# Altium project US_EPS_HW.PrjPcb (part 2 of 2)

## Sheet US_EPS_MCU.SchDoc
size A3
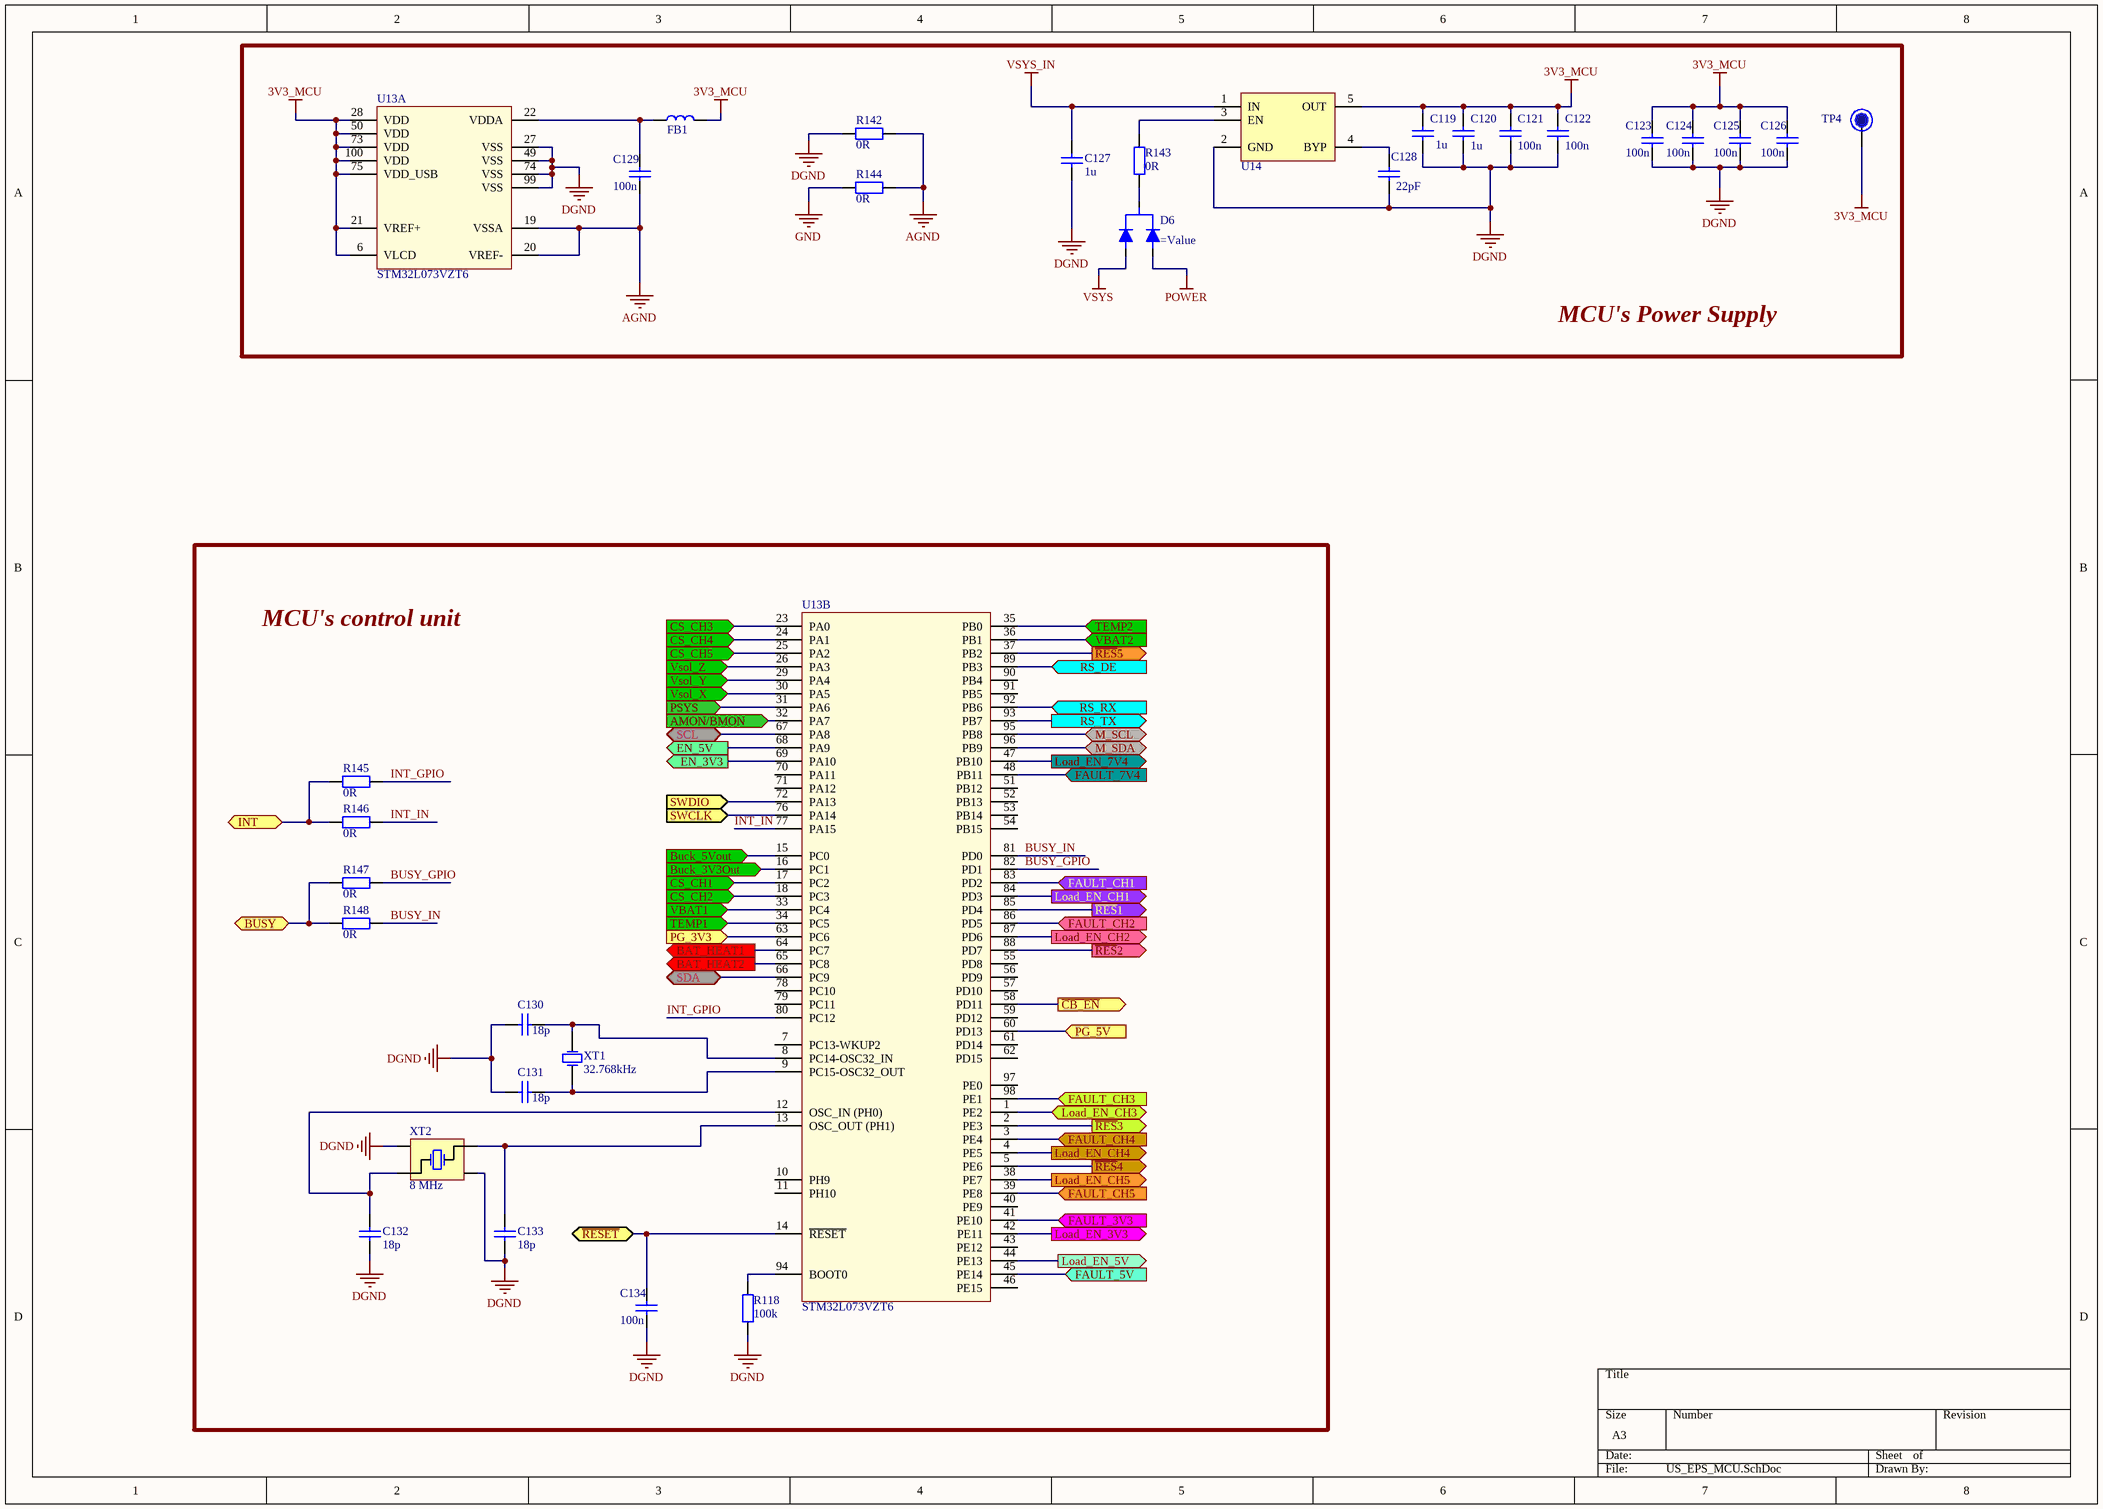
[diagram p6: US_EPS_MCU.SchDoc]

### Parts
C119  1u  [C0603_IPC_HD]
C120  1u  [C0603_IPC_HD]
C121  100n  [C0603_IPC_HD]
C122  100n  [C0603_IPC_HD]
C123  100n  [C0603_IPC_HD]
C124  100n  [C0603_IPC_HD]
C125  100n  [C0603_IPC_HD]
C126  100n  [C0603_IPC_HD]
C127  1u  [C0603_IPC_HD]
C128  22pF  [C0603_IPC_HD]
C129  100n  [C0603_IPC_HD]
C130  18p  [C0603_IPC_HD]
C131  18p  [C0603_IPC_HD]
C132  18p  [C0603_IPC_HD]
C133  18p  [C0603_IPC_HD]
C134  100n  [C0603_IPC_HD]
D6  (no value)  [BAT54C_SOT23]
FB1  MH1608-601Y  [L0603_IPC_MD]  (value not drawn)
R118  100k  [R0603_IPC_MD]
R142  0R  [R0603_IPC_MD]
R143  0R  [R0603_IPC_MD]
R144  0R  [R0603_IPC_MD]
R145  0R  [R0603_IPC_MD]  (no BOM)
R146  0R  [R0603_IPC_MD]  (no BOM)
R147  0R  [R0603_IPC_MD]  (no BOM)
R148  0R  [R0603_IPC_MD]  (no BOM)
TP4  Test Point  [TestPoint_1M5]  (value not drawn)  (no BOM)
U13  STM32L073VZT6  [STM32L073_TSQFP50P1600X1600X160-100N]  (parts A,B of 2)
U14  MIC5216-3.3YM5-TR  [SOT23-5_(MT)]  (value not drawn)
XT1  32.768kHz  [FC-135R]
XT2  8 MHz  [5.0X3.2_4PAD_SMT]

### Blocks framed on the sheet
MCU's Power Supply: C119-C129 D6 FB1 R142-R144 TP4 U13 U14
MCU's control unit: C130-C134 R118 R145-R148 U13 XT1 XT2

### Ports
AMON/BMON (in), BAT_HEAT1 (out), BAT_HEAT2 (out), Buck_3V3Out (in), Buck_5Vout (in), BUSY, CS_CH1 (in), CS_CH2 (in), CS_CH3 (in), CS_CH4 (in), CS_CH5 (in), EN_3V3 (out), EN_5V (out), FAULT_3V3 (in), FAULT_5V (in), FAULT_7V4 (in), FAULT_CH1 (in), FAULT_CH2 (in), FAULT_CH3 (in), FAULT_CH4 (in), FAULT_CH5 (in), INT, Load_EN_3V3 (out), Load_EN_5V (out), Load_EN_7V4 (out), Load_EN_CH1 (out), Load_EN_CH2 (out), Load_EN_CH3, Load_EN_CH4 (out), Load_EN_CH5 (out), M_SCL, M_SDA, PG_3V3 (in), PG_5V (in), PSYS (in), RS_DE (in), RS_RX (in), RS_TX (out), SCL, SDA, SWCLK (in), SWDIO (in), TEMP1 (in), TEMP2 (in), VBAT1 (in), VBAT2 (in), Vsol_X (in), Vsol_Y (in), Vsol_Z (in), ~{CB_EN} (out), ~{RESET}, ~{RES}1 (out), ~{RES}2 (out), ~{RES}3 (out), ~{RES}4 (out), ~{RES}5 (out)

### Nets
3V3_MCU: C119.2 C120.2 C121.2 C122.2 C123.2 C124.2 C125.2 C126.2 FB1.2 TP4.0 U13.6(VLCD) U13.21(VREF+) U13.28(VDD) U13.50(VDD) U13.73(VDD) U13.75(VDD_USB) U13.100(VDD) U14.5(OUT)
AGND: C129.1 R142.1 R144.1 U13.19(VSSA) U13.20(VREF-)
DGND: C119.1 C120.1 C121.1 C122.1 C123.1 C124.1 C125.1 C126.1 C127.1 C128.1 C130.1 C131.1 C132.1 C133.1 C134.1 R118.1 R142.2 U13.27(VSS) U13.49(VSS) U13.74(VSS) U13.99(VSS) U14.2(GND) XT2.2(NC) XT2.4(NC)
GND: R144.2
POWER: D6.2
VSYS: D6.1
VSYS_IN: C127.2 U14.1(IN)
BUSY_GPIO: R147.1 U13.82(PD1)
BUSY_IN: R148.1 U13.81(PD0)
INT_GPIO: R145.1 U13.80(PC12)
INT_IN: R146.1 U13.77(PA15)
NetC128_2: C128.2 U14.4(BYP)
NetC129_2: C129.2 FB1.1 U13.22(VDDA)
NetC130_2: C130.2 U13.8(PC14-OSC32_IN) XT1.2(OSC2)
NetC131_2: C131.2 U13.9(PC15-OSC32_OUT) XT1.1(OSC1)
NetC132_2: C132.2 U13.12(OSC_IN_(PH0)) XT2.3(OSC2)
NetC133_2: C133.2 U13.13(OSC_OUT_(PH1)) XT2.1(OSC1)
NetC134_2: C134.2 U13.14(~{RESET}) ; port ~{RESET}
NetD6_3: D6.3 R143.1
NetR118_2: R118.2 U13.94(BOOT0)
NetR143_2: R143.2 U14.3(EN)
NetR145_2: R145.2 R146.2 ; port INT
NetR147_2: R147.2 R148.2 ; port BUSY
NetU13_1: U13.1(PE2) ; port Load_EN_CH3
NetU13_2: U13.2(PE3) ; port ~{RES}3
NetU13_3: U13.3(PE4) ; port FAULT_CH4
NetU13_4: U13.4(PE5) ; port Load_EN_CH4
NetU13_5: U13.5(PE6) ; port ~{RES}4
NetU13_15: U13.15(PC0) ; port Buck_5Vout
NetU13_16: U13.16(PC1) ; port Buck_3V3Out
NetU13_17: U13.17(PC2) ; port CS_CH1
NetU13_18: U13.18(PC3) ; port CS_CH2
NetU13_23: U13.23(PA0) ; port CS_CH3
NetU13_24: U13.24(PA1) ; port CS_CH4
NetU13_25: U13.25(PA2) ; port CS_CH5
NetU13_26: U13.26(PA3) ; port Vsol_Z
NetU13_29: U13.29(PA4) ; port Vsol_Y
NetU13_30: U13.30(PA5) ; port Vsol_X
NetU13_31: U13.31(PA6) ; port PSYS
NetU13_32: U13.32(PA7) ; port AMON/BMON
NetU13_33: U13.33(PC4) ; port VBAT1
NetU13_34: U13.34(PC5) ; port TEMP1
NetU13_35: U13.35(PB0) ; port TEMP2
NetU13_36: U13.36(PB1) ; port VBAT2
NetU13_37: U13.37(PB2) ; port ~{RES}5
NetU13_38: U13.38(PE7) ; port Load_EN_CH5
NetU13_39: U13.39(PE8) ; port FAULT_CH5
NetU13_41: U13.41(PE10) ; port FAULT_3V3
NetU13_42: U13.42(PE11) ; port Load_EN_3V3
NetU13_44: U13.44(PE13) ; port Load_EN_5V
NetU13_45: U13.45(PE14) ; port FAULT_5V
NetU13_47: U13.47(PB10) ; port Load_EN_7V4
NetU13_48: U13.48(PB11) ; port FAULT_7V4
NetU13_58: U13.58(PD11) ; port ~{CB_EN}
NetU13_60: U13.60(PD13) ; port PG_5V
NetU13_63: U13.63(PC6) ; port PG_3V3
NetU13_64: U13.64(PC7) ; port BAT_HEAT1
NetU13_65: U13.65(PC8) ; port BAT_HEAT2
NetU13_66: U13.66(PC9) ; port SDA
NetU13_67: U13.67(PA8) ; port SCL
NetU13_68: U13.68(PA9) ; port EN_5V
NetU13_69: U13.69(PA10) ; port EN_3V3
NetU13_72: U13.72(PA13) ; port SWDIO
NetU13_76: U13.76(PA14) ; port SWCLK
NetU13_83: U13.83(PD2) ; port FAULT_CH1
NetU13_84: U13.84(PD3) ; port Load_EN_CH1
NetU13_85: U13.85(PD4) ; port ~{RES}1
NetU13_86: U13.86(PD5) ; port FAULT_CH2
NetU13_87: U13.87(PD6) ; port Load_EN_CH2
NetU13_88: U13.88(PD7) ; port ~{RES}2
NetU13_89: U13.89(PB3) ; port RS_DE
NetU13_92: U13.92(PB6) ; port RS_RX
NetU13_93: U13.93(PB7) ; port RS_TX
NetU13_95: U13.95(PB8) ; port M_SCL
NetU13_96: U13.96(PB9) ; port M_SDA
NetU13_98: U13.98(PE1) ; port FAULT_CH3

Not connected (* = marked no-connect by the designer): U13 7(PC13-WKUP2) 10(PH9) 11(PH10) 40(PE9) 43(PE12) 46(PE15) 51(PB12) 52(PB13) 53(PB14) 54(PB15) 55(PD8) 56(PD9) 57(PD10) 59(PD12) 61(PD14) 62(PD15) 70(PA11) 71(PA12) 78(PC10) 79(PC11) 90(PB4) 91(PB5) 97(PE0)

### Library data of the parts
C119 C120 C127 = CL10B105MO8NNWC: CAP CER 1UF 16V X7R 0603; Manufacturer: Samsung Electro-Mechanics; Manufacturer Part Number: CL10B105MO8NNWC; Voltage: 16V; Value: 1u; Dielectric: X7R; Supplier 1: Digi-Key; Supplier Part Number 1: 1276-6524-1-ND
C121-C126 C129 C134 = CL10B104KO8NNNC: CAP CER 0.1UF 16V X7R 0603; Manufacturer: Samsung Electro-Mechanics; Manufacturer Part Number: CL10B104KO8NNNC; Voltage: 16V; Value: 100n; Dielectric: X7R; Supplier 1: Digi-Key; Supplier Part Number 1: 1276-1005-1-ND
C128 = CL0603_22pF_50V: CAP CER 22PF 50V C0G/NP0 0603; Manufacturer: Wurth Electronics Inc.; Manufacturer Part Number: 885012006053; Dielectric: X7R; Voltage: 50V; Value: 22pF; Supplier 1: Digi-Key; Supplier Part Number 1: 732-7795-1-ND
C130-C133 = CL10C180JB8NNNC: CAP CER 18PF 50V C0G/NP0 0603; Manufacturer: Samsung Electro-Mechanics; Manufacturer Part Number: CL10C180JB8NNNC; Voltage: 50V; Value: 18p; Dielectric: C0G/NP0; Supplier 1: Digi-Key; Supplier Part Number 1: 1276-1089-1-ND
D6 = BAT54CQ-7: Diode Schottky 30V 200mA Surface Mount SOT-23(ISL9237); Manufacturer: Diodes Incorporated; Manufacturer Part Number: BAT54CQ-7-F; Reverse Recovery Time (trr): 5ns; Voltage - DC Reverse (Vr) (Max): 30V; Supplier 1: Digi-Key; Supplier Part Number 1: BAT54CQ-7-FDICT-ND; Current - Average Rectified (Io): 200mA
FB1 = MH1608-601Y: FERRITE BEAD 600R@100MHz 0603 for Power Line, 1000mA; Manufacturer: Bourns Inc.; Manufacturer Part Number: MH1608-601Y; Supplier 1: Digi-Key; Supplier Part Number 1: MH1608-601YCT-ND
R118 = CR0603-JW-104ELF: RES 100K OHM 1% 1/10W 0603; Manufacturer: Stackpole Electronics Inc; Manufacturer Part Number: RMCF0603FT100K; Value: 100k; Tolarance: ±1%; Supplier 1: Digi-Key; Supplier Part Number 1: RMCF0603FT100KCT-ND
R142-R148 = CR0603-J/-000ELF: RES SMD 0 OHM JUMPER 1/10W 0603; Manufacturer: Bourns Inc.; Tolarance: 1%; Value: 0R; Manufacturer Part Number: CR0603-J/-000ELF; Supplier 1: Digi-Key; Supplier Part Number 1: CR0603-J/-000ELFCT-ND
TP4 = TP
U13 = STM32L073VZT6_EPS: ARM® Cortex®-M0+ STM32L0 Microcontroller IC 32-Bit 32MHz 192KB (192K x 8) FLASH 100-LQFP (14x14); Manufacturer: STMicroelectronics; SRAM: 20KB; Manufacturer Part Number: STM32L073VZT6; FLASH: 192KB; Supplier 1: Digi-Key; Supplier Part Number 1: 497-17508-ND
U14 = MIC5216-3.3YM5-TR: IC REG LINEAR 3.3V 500MA SOT23-5; Manufacturer: Microchip Technology; Manufacturer Part Number: MIC5216-3.3YM5-TR; Supplier 1: Digi-Key; Supplier Part Number 1: 576-2756-1-ND
XT1 = FC-135-32.7680K: 32.768kHz ±20ppm Crystal 12.5pF 70 kOhms 2-SMD, No Lead; Manufacturer: EPSON; Manufacturer Part Number: FC-135 32.7680KA-A5; Frequency: 32.768kHz; Tolarance: ±20ppm; Supplier 1: Digi-Key; Supplier Part Number 1: SER4103CT-ND
XT2 = ABM3B-8.000MHZ-10-1-U-T: 8MHz ±10ppm Crystal 10pF 200 Ohms 4-SMD, No Lead; Manufacturer: Abracon LLC; Manufacturer Part Number: ABM3B-8.000MHZ-10-1-U-T; Type: XTAL; Value: 8 MHz

## Sheet US_EPS_RBF.SchDoc
size A4
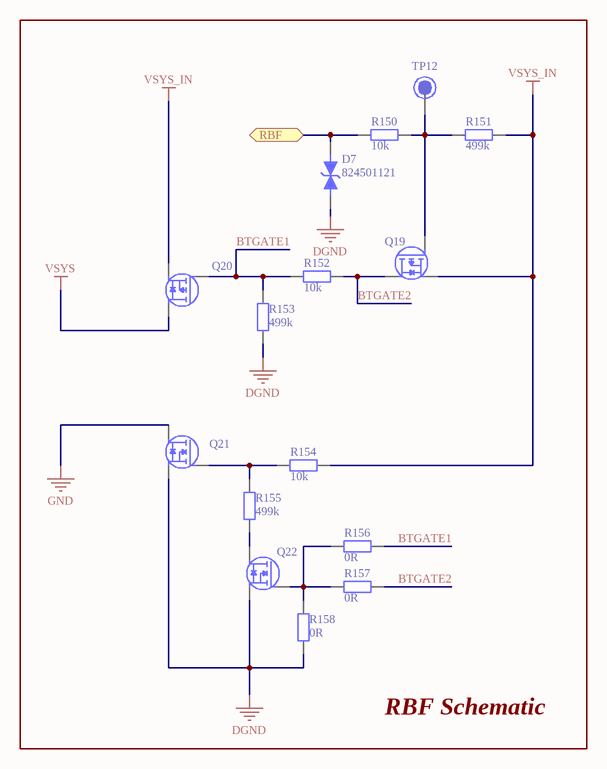
[diagram p7: US_EPS_RBF.SchDoc]

### Parts
D7  824501121  [DIOM4227X25N]
Q19  SISH625DN-T1-GE3  [SISH625DN]  (value not drawn)
Q20  SISH625DN-T1-GE3  [SISH625DN]  (value not drawn)
Q21  SISA14DN-T1-GE3  [SISA14DN]  (value not drawn)
Q22  SISA14DN-T1-GE3  [SISA14DN]  (value not drawn)
R150  10k  [C0603_IPC_HD]
R151  499k  [C0603_IPC_HD]
R152  10k  [C0603_IPC_HD]
R153  499k  [C0603_IPC_HD]
R154  10k  [C0603_IPC_HD]
R155  499k  [C0603_IPC_HD]
R156  0R  [R0603_IPC_MD]
R157  0R  [R0603_IPC_MD]
R158  0R  [R0603_IPC_MD]
TP12  Test Point  [TestPoint_1M5]  (value not drawn)  (no BOM)

### Blocks framed on the sheet
RBF Schematic: D7 Q19-Q22 R150-R158 TP12

### Ports
RBF

### Nets
DGND: D7.1 Q21.1(S) Q22.1(S) R153.1 R158.1
GND: Q21.3(D)
VSYS: Q20.3(D)
VSYS_IN: Q19.1(S) Q20.1(S) R151.1 R154.2
BTGATE1: Q20.2(G) R152.1 R153.2 R156.2
BTGATE2: Q19.3(D) R152.2 R157.2
NetD7_2: D7.2 R150.1 ; port RBF
NetQ19_2: Q19.2(G) R150.2 R151.2 TP12.0
NetQ21_2: Q21.2(G) R154.1 R155.2
NetQ22_2: Q22.2(G) R156.1 R157.1 R158.2
NetQ22_3: Q22.3(D) R155.1

### Library data of the parts
D7 = 824501121_TVS: TVS DIODE 12V 19.9V DO214AC; Manufacturer: Wurth Electronics Inc.; Voltage - Reverse Standoff (Typ): 12V (Max); Current - Average Rectified (Io): 1A; Manufacturer Part Number: 824501121; Supplier 1: Digi-Key; Supplier Part Number 1: 732-9949-1-ND
Q19 Q20 = SISH625DN-T1: P-Channel 30V 17.3A (Ta), 35A (Tc) 3.7W (Ta), 52W (Tc) Surface Mount PowerPAK® 1212-8SH; Manufacturer: Vishay Siliconix; Manufacturer Part Number: SISH625DN-T1-GE3; Supplier 1: Digi-Key; Supplier Part Number 1: SISH625DN-T1-GE3CT-ND
Q21 Q22 = SiSA14DN: N-Channel 30V 20A (Tc) 3.57W (Ta), 26.5W (Tc) Surface Mount PowerPAK® 1212-8; Manufacturer: Vishay Siliconix; Manufacturer Part Number: SISA14DN-T1-GE3; Supplier 1: Digi-Key; Supplier Part Number 1: SISA14DN-T1-GE3CT-ND
R150 R152 R154 = CR0603-JW-10k: RES 10K OHM 1% 1/10W 0603; Manufacturer: Stackpole Electronics Inc; Manufacturer Part Number: RMCF0603FT10K0; Value: 10k; Tolarance: ±1%; Supplier 1: Digi-Key; Supplier Part Number 1: RMCF0603FT10K0CT-ND
R151 R153 R155 = CR0603-JW-499K: RES 499K OHM 1% 1/10W 0603; Manufacturer: Stackpole Electronics Inc; Manufacturer Part Number: RMCF0603FT499K; Value: 499k; Tolarance: ±1%; Supplier 1: Digi-Key; Supplier Part Number 1: RMCF0603FT499KCT-ND
R156-R158 = CR0603-J/-000ELF: as R142 on sheet US_EPS_MCU; Value: 0R; Manufacturer Part Number: CR0603-J/-000ELF; Supplier 1: Digi-Key; Supplier Part Number 1: CR0603-J/-000ELFCT-ND
TP12 = TP

## Sheet US_EPS_RS485.SchDoc
size A4
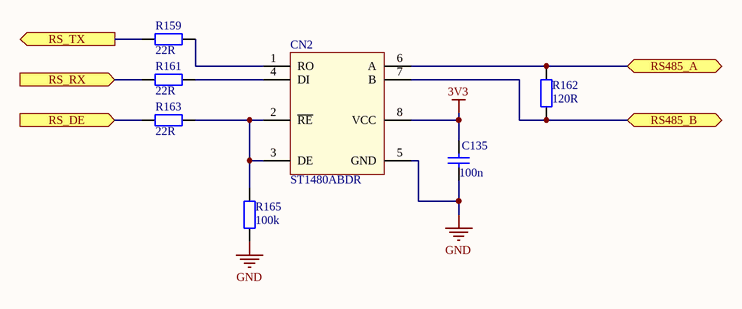
[diagram p8: US_EPS_RS485.SchDoc]

### Parts
C135  100n  [C0603_IPC_HD]
CN2  ST1480ABDR  [SOIC-8]
R159  22R  [R0603_IPC_MD]
R161  22R  [R0603_IPC_MD]
R162  120R  [C0603_IPC_MD]
R163  22R  [R0603_IPC_MD]
R165  100k  [R0603_IPC_MD]

### Ports
RS485_A (bidir), RS485_B (bidir), RS_DE (in), RS_RX (in), RS_TX (out)

### Nets
3V3: C135.2 CN2.8(VCC)
GND: C135.1 CN2.5(GND) R165.1
NetCN2_1: CN2.1(RO) R159.2
NetCN2_2: CN2.2(~{RE}) CN2.3(DE) R163.2 R165.2
NetCN2_4: CN2.4(DI) R161.2
NetCN2_6: CN2.6(A) R162.2 ; port RS485_A
NetCN2_7: CN2.7(B) R162.1 ; port RS485_B
NetR159_1: R159.1 ; port RS_TX
NetR161_1: R161.1 ; port RS_RX
NetR163_1: R163.1 ; port RS_DE

### Library data of the parts
C135 = CL10B104KO8NNNC: as C121 on sheet US_EPS_MCU; Manufacturer Part Number: CL10B104KO8NNNC; Voltage: 16V; Value: 100n; Dielectric: X7R; Supplier 1: Digi-Key; Supplier Part Number 1: 1276-1005-1-ND
CN2 = ST1480ABDR: IC TXRX 3.3V RS485/422 8 SOIC; Manufacturer: STMicroelectronics; Manufacturer Part Number: ST1480ABDR; Supplier 1: Digi-Key; Supplier Part Number 1: 497-2046-1-ND
R159 R161 R163 = CR0603-JW-220ELF: RES SMD 22 OHM 5% 1/10W 0603; Manufacturer: Bourns Inc.; Value: 22R; Tolarance: 5%; Manufacturer Part Number: CR0603-JW-220ELF; Supplier 1: Digi-Key; Supplier Part Number 1: CR0603-JW-220ELFCT-ND
R162 = RC0603JR-07120RL: RES SMD 120 OHM 5% 1/10W 0603; Manufacturer: Yageo; Value: 120R; Tolarance: 5%; Manufacturer Part Number: RC0603JR-07120RL; Supplier 1: Digi-Key; Supplier Part Number 1: 311-120GRCT-ND
R165 = CR0603-JW-104ELF: as R118 on sheet US_EPS_MCU; Value: 100k; Tolarance: ±1%; Supplier 1: Digi-Key; Supplier Part Number 1: RMCF0603FT100KCT-ND

## Sheet US_EPS_SP.SchDoc
size A4
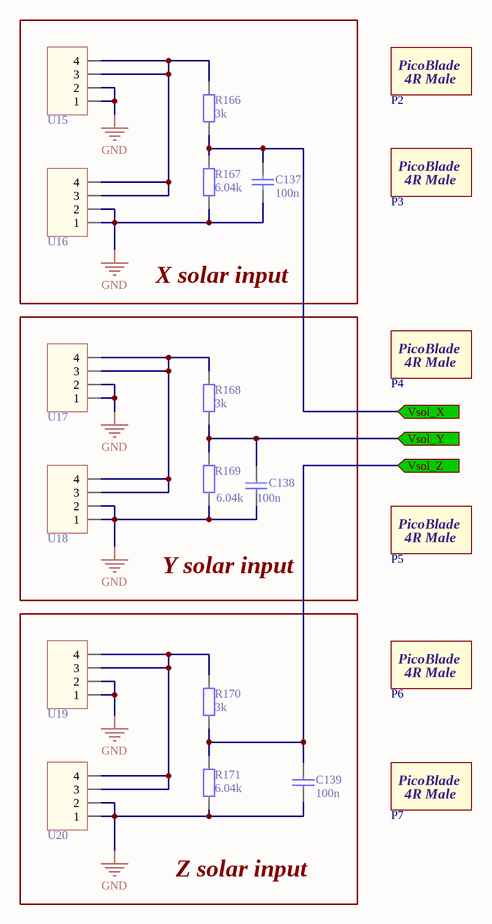
[diagram p9: US_EPS_SP.SchDoc]

### Parts
C137  100n  [C0603_IPC_HD]
C138  100n  [C0603_IPC_HD]
C139  100n  [C0603_IPC_HD]
P2  PicoBlade_4R_MALE  (value not drawn)  (mechanical)
P3  PicoBlade_4R_MALE  (value not drawn)  (mechanical)
P4  PicoBlade_4R_MALE  (value not drawn)  (mechanical)
P5  PicoBlade_4R_MALE  (value not drawn)  (mechanical)
P6  PicoBlade_4R_MALE  (value not drawn)  (mechanical)
P7  PicoBlade_4R_MALE  (value not drawn)  (mechanical)
R166  3k  [C0603_IPC_HD]
R167  6.04k  [C0603_IPC_HD]
R168  3k  [C0603_IPC_HD]
R169  6.04k  [C0603_IPC_HD]
R170  3k  [C0603_IPC_HD]
R171  6.04k  [C0603_IPC_HD]
U15  PicoBlade_4R  [PB_53261-0471_Right]  (value not drawn)
U16  PicoBlade_4R  [PB_53261-0471_Right]  (value not drawn)
U17  PicoBlade_4R  [PB_53261-0471_Right]  (value not drawn)
U18  PicoBlade_4R  [PB_53261-0471_Right]  (value not drawn)
U19  PicoBlade_4R  [PB_53261-0471_Right]  (value not drawn)
U20  PicoBlade_4R  [PB_53261-0471_Right]  (value not drawn)

### Blocks framed on the sheet
X solar input: C137 R166 R167 U15 U16
Y solar input: C138 R168 R169 U17 U18
Z solar input: C139 R170 R171 U19 U20

### Ports
Vsol_X (in), Vsol_Y (in), Vsol_Z (in)

### Nets
GND: C137.1 C138.1 C139.1 R167.1 R169.1 R171.1 U15.1 U15.2 U16.1 U16.2 U17.1 U17.2 U18.1 U18.2 U19.1 U19.2 U20.1 U20.2
NetC137_2: C137.2 R166.1 R167.2 ; port Vsol_X
NetC138_2: C138.2 R168.1 R169.2 ; port Vsol_Y
NetC139_2: C139.2 R170.1 R171.2 ; port Vsol_Z
NetR166_2: R166.2 U15.3 U15.4 U16.3 U16.4
NetR168_2: R168.2 U17.3 U17.4 U18.3 U18.4
NetR170_2: R170.2 U19.3 U19.4 U20.3 U20.4

### Notes on the sheet
- (in symbol PicoBlade_4R_M) PicoBlade; 4R Male

### Library data of the parts
C137-C139 = CL10B104KO8NNNC: as C121 on sheet US_EPS_MCU; Manufacturer Part Number: CL10B104KO8NNNC; Voltage: 16V; Value: 100n; Dielectric: X7R; Supplier 1: Digi-Key; Supplier Part Number 1: 1276-1005-1-ND
P2-P7 = PicoBlade_4R_M: MALE Connector Header Surface Mount 4 position 0.049" (1.25mm); Manufacturer: China; Manufacturer Part Number: PicoBlade_4R_MALE; Supplier 1: Aliexpress; Supplier Part Number 1: PicoBlade_4R_M
R166 R168 R170 = CR0603-JW-3k: RES SMD 3K OHM 5% 1/10W 0603; Manufacturer: Bourns Inc.; Manufacturer Part Number: CR0603-JW-302ELF; Value: 3k; Tolarance: ±5%; Supplier 1: Digi-Key; Supplier Part Number 1: CR0603-JW-302ELFCT-ND
R167 R169 R171 = CR0603-JW-6.04K: RES 6.04K OHM 1% 1/10W 0603; Manufacturer: Stackpole Electronics Inc; Manufacturer Part Number: RMCF0603FT6K04; Value: 6.04k; Tolarance: ±1%; Supplier 1: Digi-Key; Supplier Part Number 1: RMCF0603FT6K04CT-ND
U15-U20 = PicoBlade_4R: Connector Header Surface Mount 4 position 0.049" (1.25mm); Manufacturer: China; Manufacturer Part Number: PicoBlade_4R; Supplier 1: Aliexpress; Supplier Part Number 1: PicoBlade_4R

## Nets that join several sheets
3V3: US_EPS_BIC (R69.1 R70.1), US_EPS_BR (7 pins), US_EPS_LM (36 pins), US_EPS_RS485 (C135.2 CN2.8)
3V3_CH3: US_EPS_BIC (CN1.18 CN1.20), US_EPS_LM (C95.2 TP9.7 TP9.8)
3V3_CH4: US_EPS_BIC (CN1.22 CN1.24), US_EPS_LM (C105.2 TP10.7 TP10.8)
3V3_LINE: US_EPS_BIC (CN1.25 CN1.26), US_EPS_LM (C91.2 U6.5)
3V3_MCU: US_EPS_BIC (P8.5), US_EPS_HW (R34.2 X1.9 X1.10), US_EPS_MCU (18 pins)
5V: US_EPS_BR (7 pins), US_EPS_LM (16 pins)
5V_CH1: US_EPS_BIC (CN1.10 CN1.12), US_EPS_LM (C72.2 TP7.7 TP7.8)
5V_CH5: US_EPS_BIC (U4.8), US_EPS_LM (C114.2 TP11.7 TP11.8)
5V_LINE: US_EPS_BIC (CN1.27 CN1.28), US_EPS_LM (C90.2 U8.5)
7V4: US_EPS_BIC (CN1.29 CN1.30), US_EPS_LM (C102.2 U10.5)
7V4_CH2: US_EPS_BIC (CN1.14 CN1.16), US_EPS_LM (C83.2 C84.2 R90.1 TP8.6)
DGND: US_EPS_BIC (D5.1 P8.2 U4.3 U4.4), US_EPS_HW (58 pins), US_EPS_MCU (24 pins), US_EPS_RBF (5 pins)
GND: US_EPS_BIC (10 pins), US_EPS_BR (37 pins), US_EPS_LM (86 pins), US_EPS_MCU (R144.2), US_EPS_RBF (Q21.3), US_EPS_RS485 (C135.1 CN2.5 R165.1), US_EPS_SP (18 pins)
POWER: US_EPS_BIC (D5.2 U4.1 U4.2), US_EPS_HW (D1.1 Q1.3 R13.2), US_EPS_MCU (D6.2)
VSYS: US_EPS_BR (17 pins), US_EPS_LM (6 pins), US_EPS_MCU (D6.1), US_EPS_RBF (Q20.3)
VSYS_IN: US_EPS_HW (23 pins), US_EPS_MCU (C127.2 U14.1), US_EPS_RBF (Q19.1 Q20.1 R151.1 R154.2)